# Altium schematic sheet GPIO.SchDoc: GPIO Interface
size 355 x 215 mm; Engineer: Nathan Petersen; DocumentNumber: 19; SheetNumber: 19; SheetTotal: 23
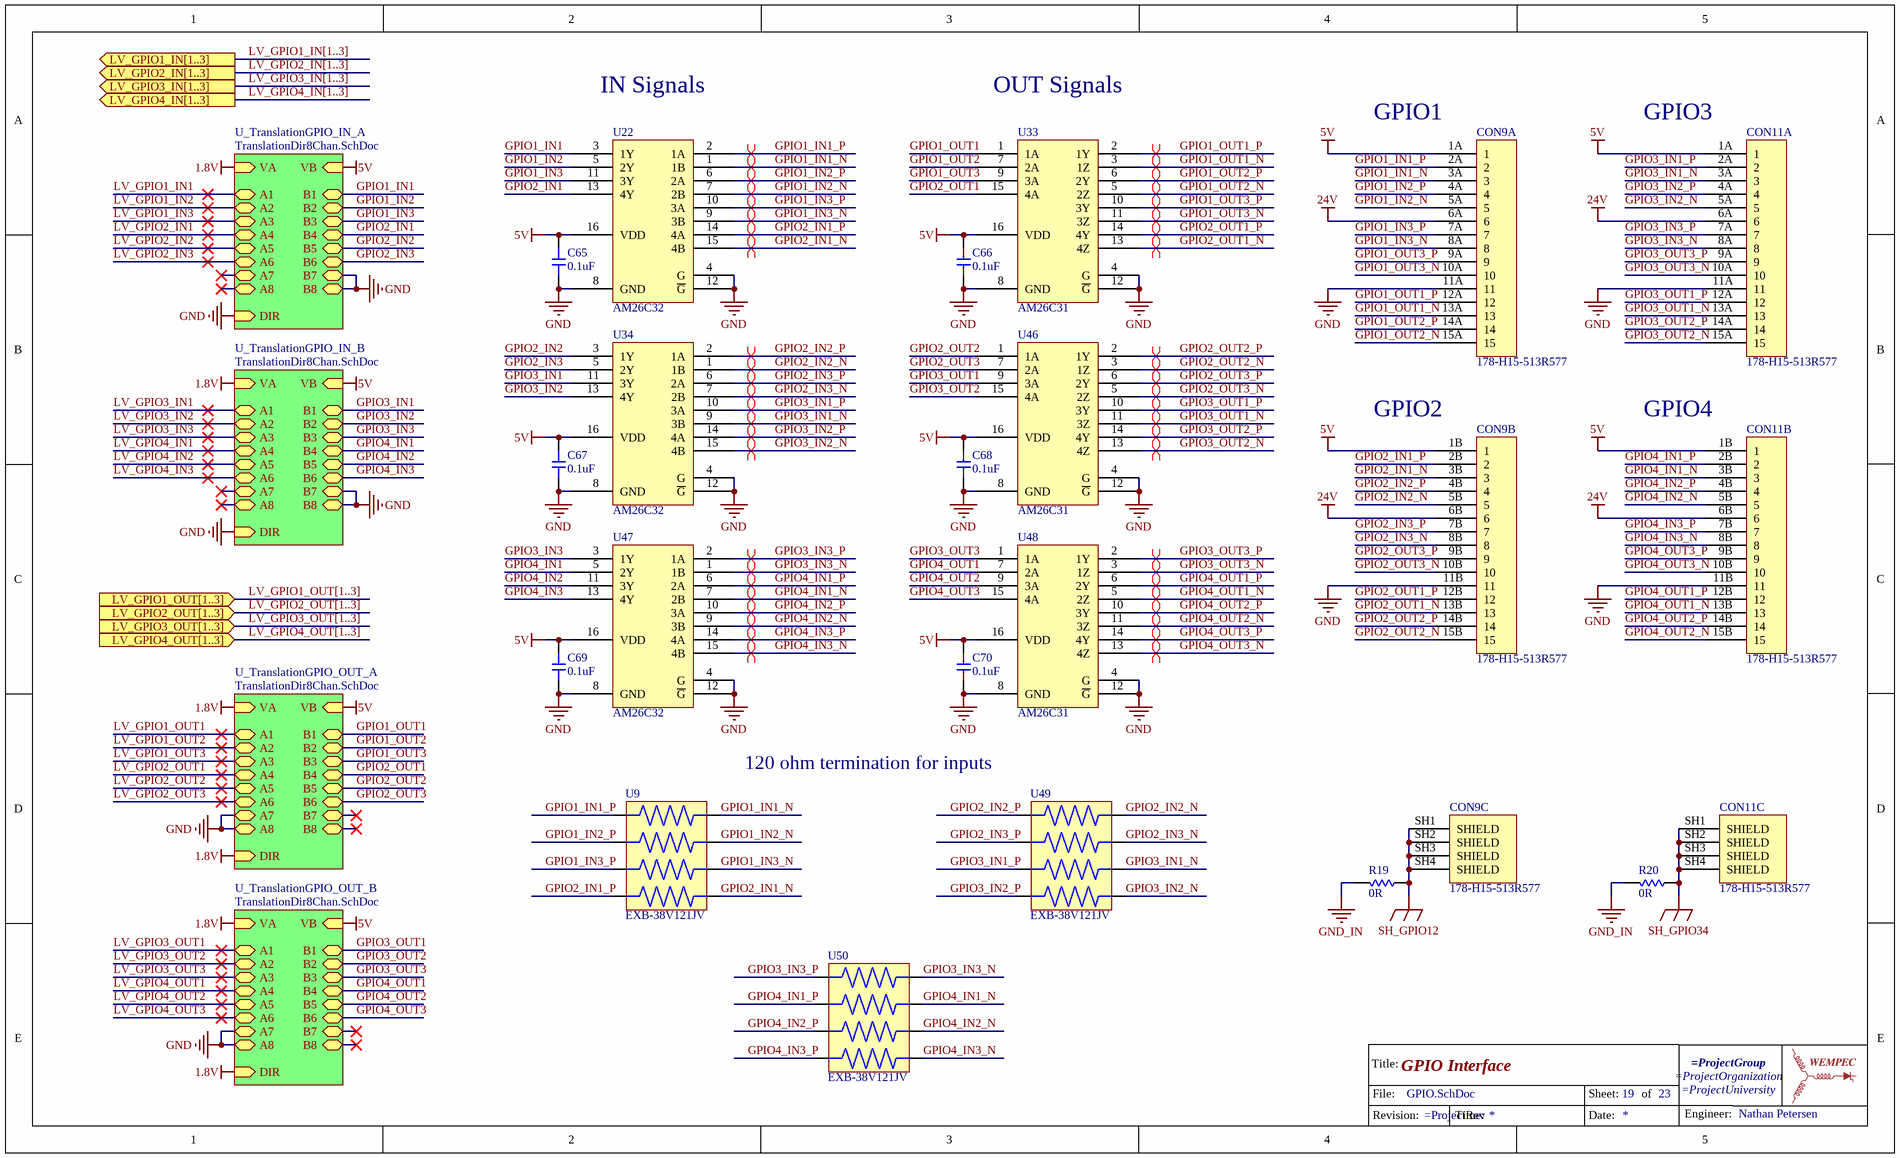
[diagram p0: GPIO.SchDoc]

## Parts
*?  TitleBlockWEMPEC  (value not drawn)  (graphical)
C65  value 0.1uF  [0603-CAP]  (hidden comment: Capacitor)
C66  value 0.1uF  [0603-CAP]  (hidden comment: Capacitor)
C67  value 0.1uF  [0603-CAP]  (hidden comment: Capacitor)
C68  value 0.1uF  [0603-CAP]  (hidden comment: Capacitor)
C69  value 0.1uF  [0603-CAP]  (hidden comment: Capacitor)
C70  value 0.1uF  [0603-CAP]  (hidden comment: Capacitor)
CON9  178-H15-513R577  [178-H15-513R577]  (parts A,B,C of 3)
CON11  178-H15-513R577  [178-H15-513R577]  (parts A,B,C of 3)
R19  value 0R  [1206-RES]  (hidden comment: Resistor)
R20  value 0R  [1206-RES]  (hidden comment: Resistor)
U9  EXB-38V121JV  [EXB-38V121JV]
U22  AM26C32  [TSOP65P640X120-16N]
U33  AM26C31  [TSOP65P640X120-16N]
U34  AM26C32  [TSOP65P640X120-16N]
U46  AM26C31  [TSOP65P640X120-16N]
U47  AM26C32  [TSOP65P640X120-16N]
U48  AM26C31  [TSOP65P640X120-16N]
U49  EXB-38V121JV  [EXB-38V121JV]
U50  EXB-38V121JV  [EXB-38V121JV]

## Sub-sheets
U_TranslationGPIO_IN_A = TranslationDir8Chan.SchDoc: VB (in), VA (in), B1 (bidir), B2 (bidir), B3 (bidir), B4 (bidir), B5 (bidir), B6 (bidir), B7 (bidir), B8 (bidir), A1 (bidir), A2 (bidir), A3 (bidir), A4 (bidir), A5 (bidir), A6 (bidir), A7 (bidir), A8 (bidir), DIR (in)
U_TranslationGPIO_IN_B = TranslationDir8Chan.SchDoc: VB (in), VA (in), B1 (bidir), B2 (bidir), B3 (bidir), B4 (bidir), B5 (bidir), B6 (bidir), B7 (bidir), B8 (bidir), A1 (bidir), A2 (bidir), A3 (bidir), A4 (bidir), A5 (bidir), A6 (bidir), A7 (bidir), A8 (bidir), DIR (in)
U_TranslationGPIO_OUT_A = TranslationDir8Chan.SchDoc: VB (in), VA (in), B1 (bidir), B2 (bidir), B3 (bidir), B4 (bidir), B5 (bidir), B6 (bidir), B7 (bidir), B8 (bidir), A1 (bidir), A2 (bidir), A3 (bidir), A4 (bidir), A5 (bidir), A6 (bidir), A7 (bidir), A8 (bidir), DIR (in)
U_TranslationGPIO_OUT_B = TranslationDir8Chan.SchDoc: VB (in), VA (in), B1 (bidir), B2 (bidir), B3 (bidir), B4 (bidir), B5 (bidir), B6 (bidir), B7 (bidir), B8 (bidir), A1 (bidir), A2 (bidir), A3 (bidir), A4 (bidir), A5 (bidir), A6 (bidir), A7 (bidir), A8 (bidir), DIR (in)

## Ports
LV_GPIO1_IN[1..3] (out), LV_GPIO1_OUT[1..3] (in), LV_GPIO2_IN[1..3] (out), LV_GPIO2_OUT[1..3] (in), LV_GPIO3_IN[1..3] (out), LV_GPIO3_OUT[1..3] (in), LV_GPIO4_IN[1..3] (out), LV_GPIO4_OUT[1..3] (in)

## Nets
1.8V: sheet U_TranslationGPIO_IN_A/VA, sheet U_TranslationGPIO_OUT_A/VA, sheet U_TranslationGPIO_OUT_A/DIR, sheet U_TranslationGPIO_IN_B/VA, sheet U_TranslationGPIO_OUT_B/VA, sheet U_TranslationGPIO_OUT_B/DIR
5V: C65.1 C66.1 C67.1 C68.1 C69.1 C70.1 CON9.1A(1) CON9.1B(1) CON11.1A(1) CON11.1B(1) U22.16(VDD) U33.16(VDD) U34.16(VDD) U46.16(VDD) U47.16(VDD) U48.16(VDD) ; sheet U_TranslationGPIO_IN_A/VB, sheet U_TranslationGPIO_OUT_A/VB, sheet U_TranslationGPIO_IN_B/VB, sheet U_TranslationGPIO_OUT_B/VB
24V: CON9.6A(6) CON9.6B(6) CON11.6A(6) CON11.6B(6)
GND: C65.2 C66.2 C67.2 C68.2 C69.2 C70.2 CON9.11A(11) CON9.11B(11) CON11.11A(11) CON11.11B(11) U22.4(G) U22.8(GND) U22.12(~{G}) U33.4(G) U33.8(GND) U33.12(~{G}) U34.4(G) U34.8(GND) U34.12(~{G}) U46.4(G) U46.8(GND) U46.12(~{G}) U47.4(G) U47.8(GND) U47.12(~{G}) U48.4(G) U48.8(GND) U48.12(~{G}) ; sheet U_TranslationGPIO_IN_A/B7, sheet U_TranslationGPIO_IN_A/B8, sheet U_TranslationGPIO_IN_A/DIR, sheet U_TranslationGPIO_OUT_A/A7, sheet U_TranslationGPIO_OUT_A/A8, sheet U_TranslationGPIO_IN_B/B7, sheet U_TranslationGPIO_IN_B/B8, sheet U_TranslationGPIO_IN_B/DIR, sheet U_TranslationGPIO_OUT_B/A7, sheet U_TranslationGPIO_OUT_B/A8
GND_IN: R19.2 R20.2
SH_GPIO12: CON9.SH1(SHIELD) CON9.SH2(SHIELD) CON9.SH3(SHIELD) CON9.SH4(SHIELD) R19.1
SH_GPIO34: CON11.SH1(SHIELD) CON11.SH2(SHIELD) CON11.SH3(SHIELD) CON11.SH4(SHIELD) R20.1
GPIO1_IN1: U22.3(1Y) ; sheet U_TranslationGPIO_IN_A/B1
GPIO1_IN1_N: CON9.3A(3) U9.8 U22.1(1B)
GPIO1_IN1_P: CON9.2A(2) U9.1 U22.2(1A)
GPIO1_IN2: U22.5(2Y) ; sheet U_TranslationGPIO_IN_A/B2
GPIO1_IN2_N: CON9.5A(5) U9.7 U22.7(2B)
GPIO1_IN2_P: CON9.4A(4) U9.2 U22.6(2A)
GPIO1_IN3: U22.11(3Y) ; sheet U_TranslationGPIO_IN_A/B3
GPIO1_IN3_N: CON9.8A(8) U9.6 U22.9(3B)
GPIO1_IN3_P: CON9.7A(7) U9.3 U22.10(3A)
GPIO1_OUT1: U33.1(1A) ; sheet U_TranslationGPIO_OUT_A/B1
GPIO1_OUT1_N: CON9.13A(13) U33.3(1Z)
GPIO1_OUT1_P: CON9.12A(12) U33.2(1Y)
GPIO1_OUT2: U33.7(2A) ; sheet U_TranslationGPIO_OUT_A/B2
GPIO1_OUT2_N: CON9.15A(15) U33.5(2Z)
GPIO1_OUT2_P: CON9.14A(14) U33.6(2Y)
GPIO1_OUT3: U33.9(3A) ; sheet U_TranslationGPIO_OUT_A/B3
GPIO1_OUT3_N: CON9.10A(10) U33.11(3Z)
GPIO1_OUT3_P: CON9.9A(9) U33.10(3Y)
GPIO2_IN1: U22.13(4Y) ; sheet U_TranslationGPIO_IN_A/B4
GPIO2_IN1_N: CON9.3B(3) U9.5 U22.15(4B)
GPIO2_IN1_P: CON9.2B(2) U9.4 U22.14(4A)
GPIO2_IN2: U34.3(1Y) ; sheet U_TranslationGPIO_IN_A/B5
GPIO2_IN2_N: CON9.5B(5) U34.1(1B) U49.8
GPIO2_IN2_P: CON9.4B(4) U34.2(1A) U49.1
GPIO2_IN3: U34.5(2Y) ; sheet U_TranslationGPIO_IN_A/B6
GPIO2_IN3_N: CON9.8B(8) U34.7(2B) U49.7
GPIO2_IN3_P: CON9.7B(7) U34.6(2A) U49.2
GPIO2_OUT1: U33.15(4A) ; sheet U_TranslationGPIO_OUT_A/B4
GPIO2_OUT1_N: CON9.13B(13) U33.13(4Z)
GPIO2_OUT1_P: CON9.12B(12) U33.14(4Y)
GPIO2_OUT2: U46.1(1A) ; sheet U_TranslationGPIO_OUT_A/B5
GPIO2_OUT2_N: CON9.15B(15) U46.3(1Z)
GPIO2_OUT2_P: CON9.14B(14) U46.2(1Y)
GPIO2_OUT3: U46.7(2A) ; sheet U_TranslationGPIO_OUT_A/B6
GPIO2_OUT3_N: CON9.10B(10) U46.5(2Z)
GPIO2_OUT3_P: CON9.9B(9) U46.6(2Y)
GPIO3_IN1: U34.11(3Y) ; sheet U_TranslationGPIO_IN_B/B1
GPIO3_IN1_N: CON11.3A(3) U34.9(3B) U49.6
GPIO3_IN1_P: CON11.2A(2) U34.10(3A) U49.3
GPIO3_IN2: U34.13(4Y) ; sheet U_TranslationGPIO_IN_B/B2
GPIO3_IN2_N: CON11.5A(5) U34.15(4B) U49.5
GPIO3_IN2_P: CON11.4A(4) U34.14(4A) U49.4
GPIO3_IN3: U47.3(1Y) ; sheet U_TranslationGPIO_IN_B/B3
GPIO3_IN3_N: CON11.8A(8) U47.1(1B) U50.8
GPIO3_IN3_P: CON11.7A(7) U47.2(1A) U50.1
GPIO3_OUT1: U46.9(3A) ; sheet U_TranslationGPIO_OUT_B/B1
GPIO3_OUT1_N: CON11.13A(13) U46.11(3Z)
GPIO3_OUT1_P: CON11.12A(12) U46.10(3Y)
GPIO3_OUT2: U46.15(4A) ; sheet U_TranslationGPIO_OUT_B/B2
GPIO3_OUT2_N: CON11.15A(15) U46.13(4Z)
GPIO3_OUT2_P: CON11.14A(14) U46.14(4Y)
GPIO3_OUT3: U48.1(1A) ; sheet U_TranslationGPIO_OUT_B/B3
GPIO3_OUT3_N: CON11.10A(10) U48.3(1Z)
GPIO3_OUT3_P: CON11.9A(9) U48.2(1Y)
GPIO4_IN1: U47.5(2Y) ; sheet U_TranslationGPIO_IN_B/B4
GPIO4_IN1_N: CON11.3B(3) U47.7(2B) U50.7
GPIO4_IN1_P: CON11.2B(2) U47.6(2A) U50.2
GPIO4_IN2: U47.11(3Y) ; sheet U_TranslationGPIO_IN_B/B5
GPIO4_IN2_N: CON11.5B(5) U47.9(3B) U50.6
GPIO4_IN2_P: CON11.4B(4) U47.10(3A) U50.3
GPIO4_IN3: U47.13(4Y) ; sheet U_TranslationGPIO_IN_B/B6
GPIO4_IN3_N: CON11.8B(8) U47.15(4B) U50.5
GPIO4_IN3_P: CON11.7B(7) U47.14(4A) U50.4
GPIO4_OUT1: U48.7(2A) ; sheet U_TranslationGPIO_OUT_B/B4
GPIO4_OUT1_N: CON11.13B(13) U48.5(2Z)
GPIO4_OUT1_P: CON11.12B(12) U48.6(2Y)
GPIO4_OUT2: U48.9(3A) ; sheet U_TranslationGPIO_OUT_B/B5
GPIO4_OUT2_N: CON11.15B(15) U48.11(3Z)
GPIO4_OUT2_P: CON11.14B(14) U48.10(3Y)
GPIO4_OUT3: U48.15(4A) ; sheet U_TranslationGPIO_OUT_B/B6
GPIO4_OUT3_N: CON11.10B(10) U48.13(4Z)
GPIO4_OUT3_P: CON11.9B(9) U48.14(4Y)
LV_GPIO1_IN1: sheet U_TranslationGPIO_IN_A/A1
LV_GPIO1_IN2: sheet U_TranslationGPIO_IN_A/A2
LV_GPIO1_IN3: sheet U_TranslationGPIO_IN_A/A3
LV_GPIO1_OUT1: sheet U_TranslationGPIO_OUT_A/A1
LV_GPIO1_OUT2: sheet U_TranslationGPIO_OUT_A/A2
LV_GPIO1_OUT3: sheet U_TranslationGPIO_OUT_A/A3
LV_GPIO2_IN1: sheet U_TranslationGPIO_IN_A/A4
LV_GPIO2_IN2: sheet U_TranslationGPIO_IN_A/A5
LV_GPIO2_IN3: sheet U_TranslationGPIO_IN_A/A6
LV_GPIO2_OUT1: sheet U_TranslationGPIO_OUT_A/A4
LV_GPIO2_OUT2: sheet U_TranslationGPIO_OUT_A/A5
LV_GPIO2_OUT3: sheet U_TranslationGPIO_OUT_A/A6
LV_GPIO3_IN1: sheet U_TranslationGPIO_IN_B/A1
LV_GPIO3_IN2: sheet U_TranslationGPIO_IN_B/A2
LV_GPIO3_IN3: sheet U_TranslationGPIO_IN_B/A3
LV_GPIO3_OUT1: sheet U_TranslationGPIO_OUT_B/A1
LV_GPIO3_OUT2: sheet U_TranslationGPIO_OUT_B/A2
LV_GPIO3_OUT3: sheet U_TranslationGPIO_OUT_B/A3
LV_GPIO4_IN1: sheet U_TranslationGPIO_IN_B/A4
LV_GPIO4_IN2: sheet U_TranslationGPIO_IN_B/A5
LV_GPIO4_IN3: sheet U_TranslationGPIO_IN_B/A6
LV_GPIO4_OUT1: sheet U_TranslationGPIO_OUT_B/A4
LV_GPIO4_OUT2: sheet U_TranslationGPIO_OUT_B/A5
LV_GPIO4_OUT3: sheet U_TranslationGPIO_OUT_B/A6

## Buses and harness runs
bus LV_GPIO1_IN[1..3] = port LV_GPIO1_IN[1..3]
bus LV_GPIO1_OUT[1..3] = port LV_GPIO1_OUT[1..3]
bus LV_GPIO2_IN[1..3] = port LV_GPIO2_IN[1..3]
bus LV_GPIO2_OUT[1..3] = port LV_GPIO2_OUT[1..3]
bus LV_GPIO3_IN[1..3] = port LV_GPIO3_IN[1..3]
bus LV_GPIO3_OUT[1..3] = port LV_GPIO3_OUT[1..3]
bus LV_GPIO4_IN[1..3] = port LV_GPIO4_IN[1..3]
bus LV_GPIO4_OUT[1..3] = port LV_GPIO4_OUT[1..3]

## Layout directives
differential pair: GPIO1_IN1_N, GPIO1_IN1_P, GPIO1_IN2_N, GPIO1_IN2_P, GPIO1_IN3_N, GPIO1_IN3_P, GPIO1_OUT1_N, GPIO1_OUT1_P, GPIO1_OUT2_N, GPIO1_OUT2_P, GPIO1_OUT3_N, GPIO1_OUT3_P, GPIO2_IN1_N, GPIO2_IN1_P, GPIO2_IN2_N, GPIO2_IN2_P, GPIO2_IN3_N, GPIO2_IN3_P, GPIO2_OUT1_N, GPIO2_OUT1_P, GPIO2_OUT2_N, GPIO2_OUT2_P, GPIO2_OUT3_N, GPIO2_OUT3_P, GPIO3_IN1_N, GPIO3_IN1_P, GPIO3_IN2_N, GPIO3_IN2_P, GPIO3_IN3_N, GPIO3_IN3_P, GPIO3_OUT1_N, GPIO3_OUT1_P, GPIO3_OUT2_N, GPIO3_OUT2_P, GPIO3_OUT3_N, GPIO3_OUT3_P, GPIO4_IN1_N, GPIO4_IN1_P, GPIO4_IN2_N, GPIO4_IN2_P, GPIO4_IN3_N, GPIO4_IN3_P, GPIO4_OUT1_N, GPIO4_OUT1_P, GPIO4_OUT2_N, GPIO4_OUT2_P, GPIO4_OUT3_N, GPIO4_OUT3_P

## Notes on the sheet
- IN Signals
- OUT Signals
- (near CON9) GPIO1
- (near CON11) GPIO3
- (near CON9) GPIO2
- (near CON11) GPIO4
- 120 ohm termination for inputs
- Title:
- File:
- Sheet:
- of
- Revision:
- Time:
- Date:
- Engineer:
- (in symbol TitleBlockWEMPEC) Title:; File:; Sheet:; of; Engineer:; Revision:; Time:; Date:

## Library data of the parts
CON9 CON11 = 178-H15-513R577: CONN D-SUB PLUG 15POS R/A SLDR; Supplier 1: Digi-Key; Supplier Part Number 1: NOR1831-ND
U9 U49 U50 = EXB-38V121JV: Res Thick Film Array 120 Ohm 5% ±200ppm/C ISOL 8-Pin 1206(4 X 0603) Convex SMD Automotive T/R; Manufacturer: Panasonic; Value: 120R; Voltage Rating: 50V; Circuit Type: Isolated; Number of Resistors: 4; Power Per Element: 62.5mW; Temperature Coefficient: 200ppm/°C; Number of Contacts: 8; Voltage Rating (DC): 100V; Supplier: Digi-Key; Supplier Part Number: Y9121CT-ND; Manufacturer Part Number: EXB-38V121JV; RoHS: Yes; Category: Resistor Arrays; Stock: 129474; Pricing: 1=0.13, 10=0.113, 25=0.078, 50=0.0608, 100=0.0434, 250=0.03388, 500=0.02692, 1000=0.01911 (USD); Mounting Technology: Surface Mount; Case/Package: 1206; Pins: 8; Case Code (Metric): 3216; Case Code (Imperial): 1206; Weight: 7.1E-05oz; Min Operating Temperature: -55°C; Max Operating Temperature: 125°C; Package Quantity: 1; Packaging: Tape and Reel; Tolerance: 5%; Termination: SMD/SMT; Series: EXB; Technology: THICK FILM; Length: 0.126inch; Width: 1.6mm; Height: 0.024inch; Terminal Pitch: 0.8mm; Radiation Hardening: No; Lead Free: Lead Free; RoHS Compliant: Yes; ComponentLink1URL: https://datasheet.ciiva.com/30227/aoc0000ce1-30227247.pdf?src-supplier=Onlinecomponents.com; ComponentLink1Description: https://datasheet.ciiva.com/30227/aoc0000ce1-30227247.pdf?src-supplier=Onlinecomponents.com; Supplier 1: Digi-Key; Supplier Part Number 1: Y9121CT-ND
U22 U34 U47 = AM26C32: IC RCVR RS422 QUAD DIFF 16TSSOP; Supplier 1: Digi-Key; Supplier Part Number 1: 296-30088-1-ND
U33 U46 U48 = AM26C31: IC DRIVER 4/0 16TSSOP; Supplier 1: Digi-Key; Supplier Part Number 1: 296-30087-1-ND
C65-C70 = Capacitor: Supplier 1: Digi-Key; Supplier Part Number 1: 1276-1012-6-ND
R19 R20 = Resistor: Supplier 1: Digi-Key; Supplier Part Number 1: 311-0.0ERCT-ND